# EAGLE design ningen (EAGLE 5.09)
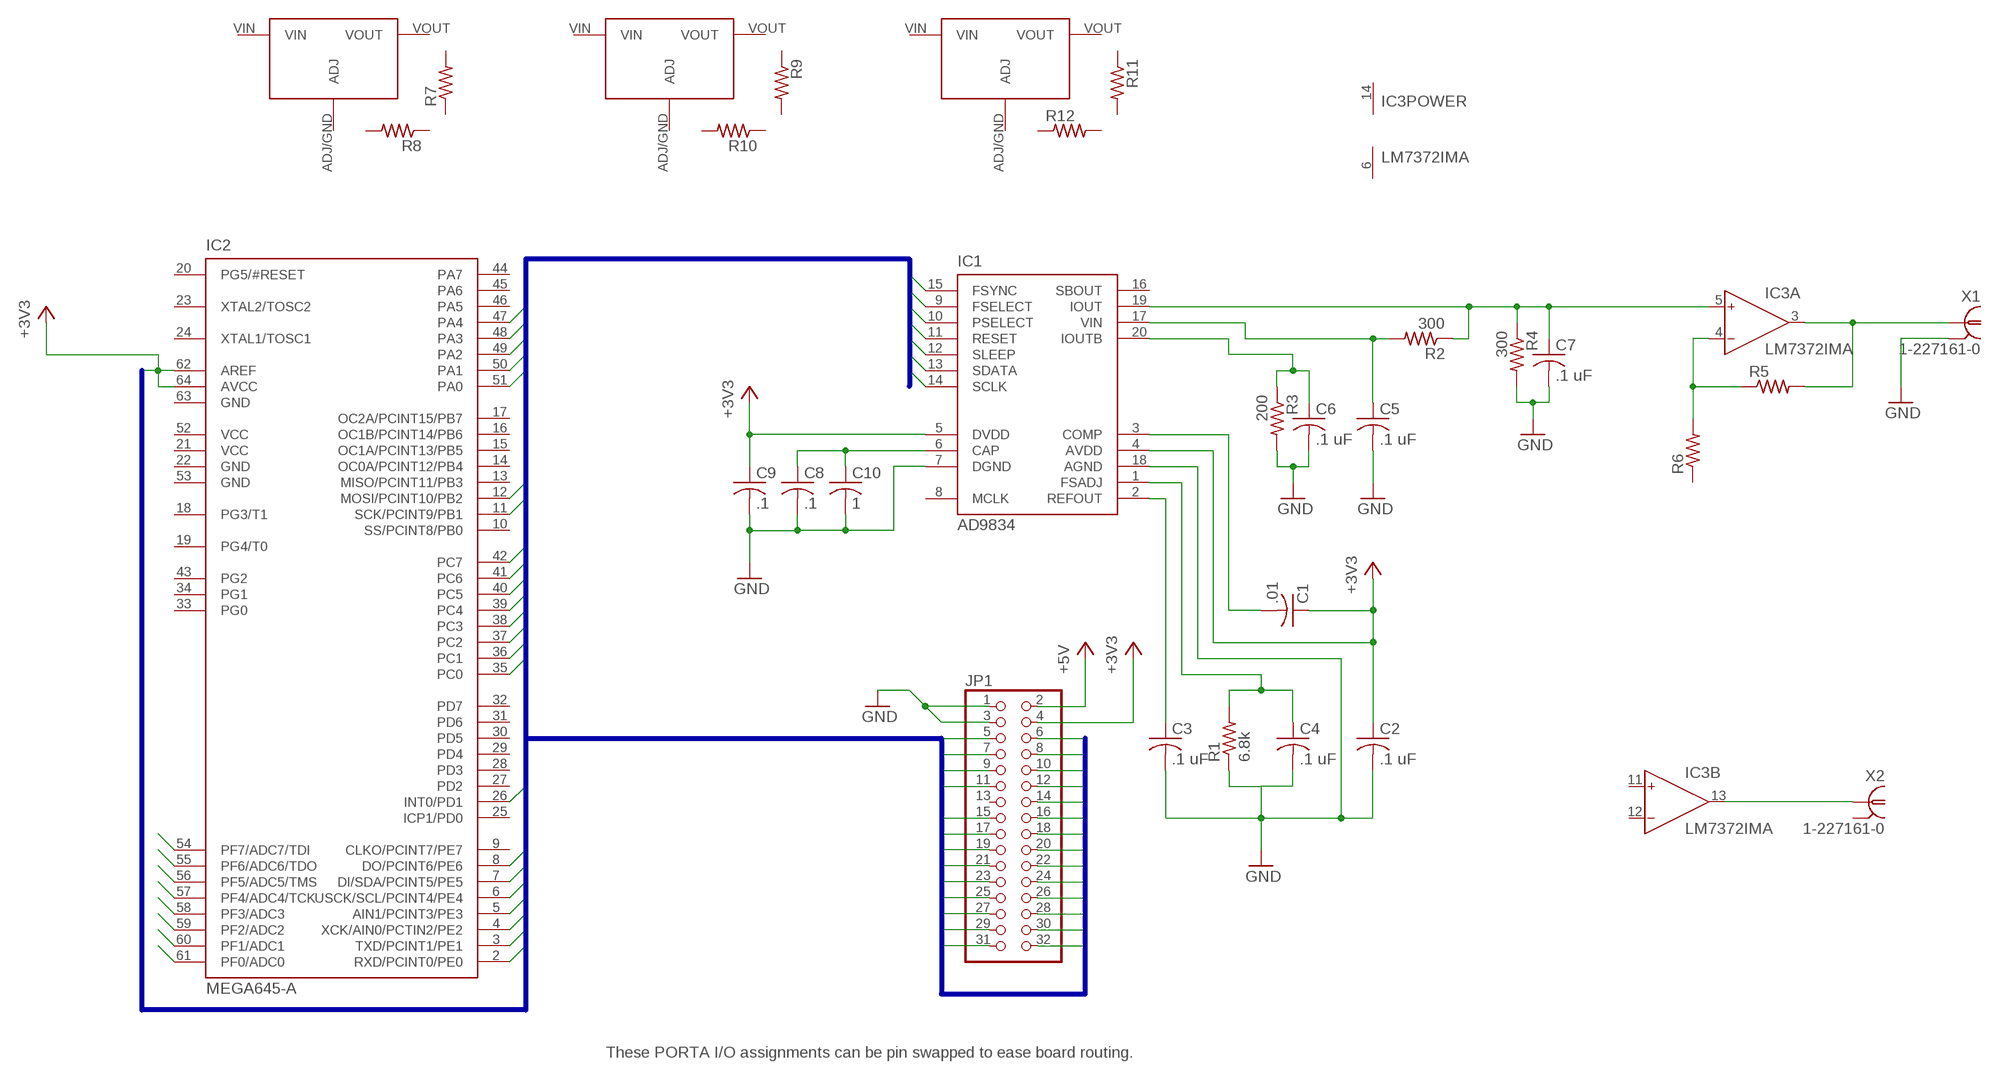
[diagram p0: schematic, sheet 1]

## Parts
C1  .01  C-USC1206  [C1206]
C2  .1 uF  C-USC1206  [C1206]
C3  .1 uF  C-USC1206  [C1206]
C4  .1 uF  C-USC1206  [C1206]
C5  .1 uF  C-USC1206  [C1206]
C6  .1 uF  C-USC1206  [C1206]
C7  .1 uF  C-USC1206  [C1206]
C8  .1  C-USC1206  [C1206]
C9  .1  C-USC1206  [C1206]
C10  1  C-USC1206  [C1206]
IC1  AD9834  [TSSOP20]
IC2  MEGA645-A  [TQFP64]
IC3  LM7372IMA  [SOIC16]
JP1  PINHD-2X16  [2X16]
R1  6.8k  R-US_R1206  [R1206]
R2  300  R-US_R1206  [R1206]
R3  200  R-US_R1206  [R1206]
R4  300  R-US_R1206  [R1206]
R5  R-US_R1206  [R1206]
R6  R-US_R1206  [R1206]
R7  R-US_M1206  [M1206]
R8  R-US_M1206  [M1206]
R9  R-US_M1206  [M1206]
R10  R-US_M1206  [M1206]
R11  R-US_M1206  [M1206]
R12  R-US_M1206  [M1206]
U$1  AP1117EG-U  [SOT-223-3L]
U$2  AP1117EG-U  [SOT-223-3L]
U$3  AP1117EG-U  [SOT-223-3L]
X1  1-227161-0  [AMP_227161]
X2  1-227161-0  [AMP_227161]

## Nets
+3V3: C1.1 C2.1 C9.1 IC1.4(AVDD) IC1.5(DVDD) JP1.2 JP1.4 ; supply symbol labelled +5V
AREF: IC2.62(AREF) IC2.64(AVCC) JP1.25 JP1.26 ; supply symbol labelled +3V3
GND: C2.2 C3.2 C4.2 C5.2 C6.2 C7.2 C8.2 C9.2 C10.2 IC1.7(DGND) IC1.18(AGND) JP1.1 JP1.3 R1.1 R3.2 R4.2 X1.2(GND)
N$1: IC3.3(A:OUT) R5.2 X1.1
N$2: IC3.13(B:OUT) X2.1
N$4: IC3.4(A:IN-) R5.1 R6.2
N$5: C8.1 C10.1 IC1.6(CAP)
N$10: C7.1 IC1.19(IOUT) IC3.5(A:IN+) R2.1 R4.1
N$11: C4.1 IC1.1(FSADJ) R1.2
N$12: C3.1 IC1.2(REFOUT)
N$13: C5.1 IC1.17(VIN) R2.2
N$15: C1.2 IC1.3(COMP)
N$17: C6.1 IC1.20(IOUTB) R3.1
PA0: IC1.12(SLEEP) IC2.51(PA0)
PA1: IC1.11(RESET) IC2.50(PA1)
PA2: IC2.49(PA2)
PA3: IC1.9(FSELECT) IC1.10(PSELECT) IC2.48(PA3)
PA4: IC1.15(FSYNC) IC2.47(PA4)
PB1: IC1.14(SCLK) IC2.11(SCK/PCINT9/PB1) IC2.12(MOSI/PCINT10/PB2)
PB2: IC1.13(SDATA)
PC0: IC2.35(PC0) JP1.5
PC1: IC2.36(PC1) JP1.6
PC2: IC2.37(PC2) JP1.7
PC3: IC2.38(PC3) JP1.8
PC4: IC2.39(PC4) JP1.9
PC5: IC2.40(PC5) JP1.10
PC6: IC2.41(PC6)
PC7: IC2.42(PC7) JP1.11 JP1.12
PD1: IC2.26(INT0/PD1) JP1.16
PE0: IC2.2(RXD/PCINT0/PE0) JP1.14
PE1: IC2.3(TXD/PCINT1/PE1) JP1.15
PE2: IC2.4(XCK/AIN0/PCTIN2/PE2) JP1.27
PE3: IC2.5(AIN1/PCINT3/PE3) JP1.28
PE4: IC2.6(USCK/SCL/PCINT4/PE4) JP1.29
PE5: IC2.7(DI/SDA/PCINT5/PE5) JP1.30
PE6: IC2.8(DO/PCINT6/PE6) JP1.31
PE7: JP1.32
PF0: IC2.61(PF0/ADC0) JP1.17
PF1: IC2.60(PF1/ADC1) JP1.18
PF2: IC2.59(PF2/ADC2) JP1.19
PF3: IC2.58(PF3/ADC3) JP1.20
PF4: IC2.57(PF4/ADC4/TCK) JP1.21
PF5: IC2.56(PF5/ADC5/TMS) JP1.22
PF6: IC2.55(PF6/ADC6/TDO) JP1.23
PF7: IC2.54(PF7/ADC7/TDI) JP1.24
Unconnected: IC1.8(MCLK) IC1.16(SBOUT) IC2.9(CLKO/PCINT7/PE7) IC2.10(SS/PCINT8/PB0) IC2.13(MISO/PCINT11/PB3) IC2.14(OC0A/PCINT12/PB4) IC2.15(OC1A/PCINT13/PB5) IC2.16(OC1B/PCINT14/PB6) IC2.17(OC2A/PCINT15/PB7) IC2.18(PG3/T1) IC2.19(PG4/T0) IC2.20(PG5/#RESET) IC2.23(XTAL2/TOSC2) IC2.24(XTAL1/TOSC1) IC2.25(ICP1/PD0) IC2.27(PD2) IC2.28(PD3) IC2.29(PD4) IC2.30(PD5) IC2.31(PD6) IC2.32(PD7) IC2.33(PG0) IC2.34(PG1) IC2.43(PG2) IC2.44(PA7) IC2.45(PA6) IC2.46(PA5) IC3.11(B:IN+) IC3.12(B:IN-) JP1.13 R6.1 R7.1 R7.2 R8.1 R8.2 R9.1 R9.2 R10.1 R10.2 R11.1 R11.2 R12.1 R12.2

## Buses
PA[0..7],PB[0..7],PC[0..7],PD[0..7],PE[0..7],PF[0..7],PG[0..4],AREF

## Notes on the sheet
- These PORTA I/O assignments can be pin swapped to ease board routing.

## Power pins joined to a net without a drawn wire
ADJ: U$1.ADJ/GND(ADJ) U$2.ADJ/GND(ADJ) U$3.ADJ/GND(ADJ)
GND: IC2.22(GND) IC2.53(GND) IC2.63(GND) X2.2(GND)
V+: IC3.14(POWER:V+)
V-: IC3.6(POWER:V-)
VCC: IC2.21(VCC) IC2.52(VCC)
VIN: U$1.VIN U$2.VIN U$3.VIN
VOUT: U$1.VOUT U$2.VOUT U$3.VOUT

## Library data of the parts
C1-C10 = rcl:C-US: CAPACITOR, American symbol
IC1 = parts:AD9834: Analog Devices AD9834
IC2 = parts:MEGA645: MICROCONTROLLER 64 Kbytes FLASH 4 Kbytes SRAM 2 Kbytes EEPROM DUAL USART 8-channel 10 bit ADC Source: avr.lbr
IC3 = parts:LM7372
JP1 = pinhead:PINHD-2X16: PIN HEADER
R1-R12 = rcl:R-US_: RESISTOR, American symbol
U$1-U$3 = parts:AP1117EG-U: DIODES, Inc. Low-Dropout 1A Adjustable Regulator
X1 X2 = con-coax:?227161*: JACK, RIGHT ANGLE, 50 OHM, PCB, BNC Source: amp_227161.pdf

## Board
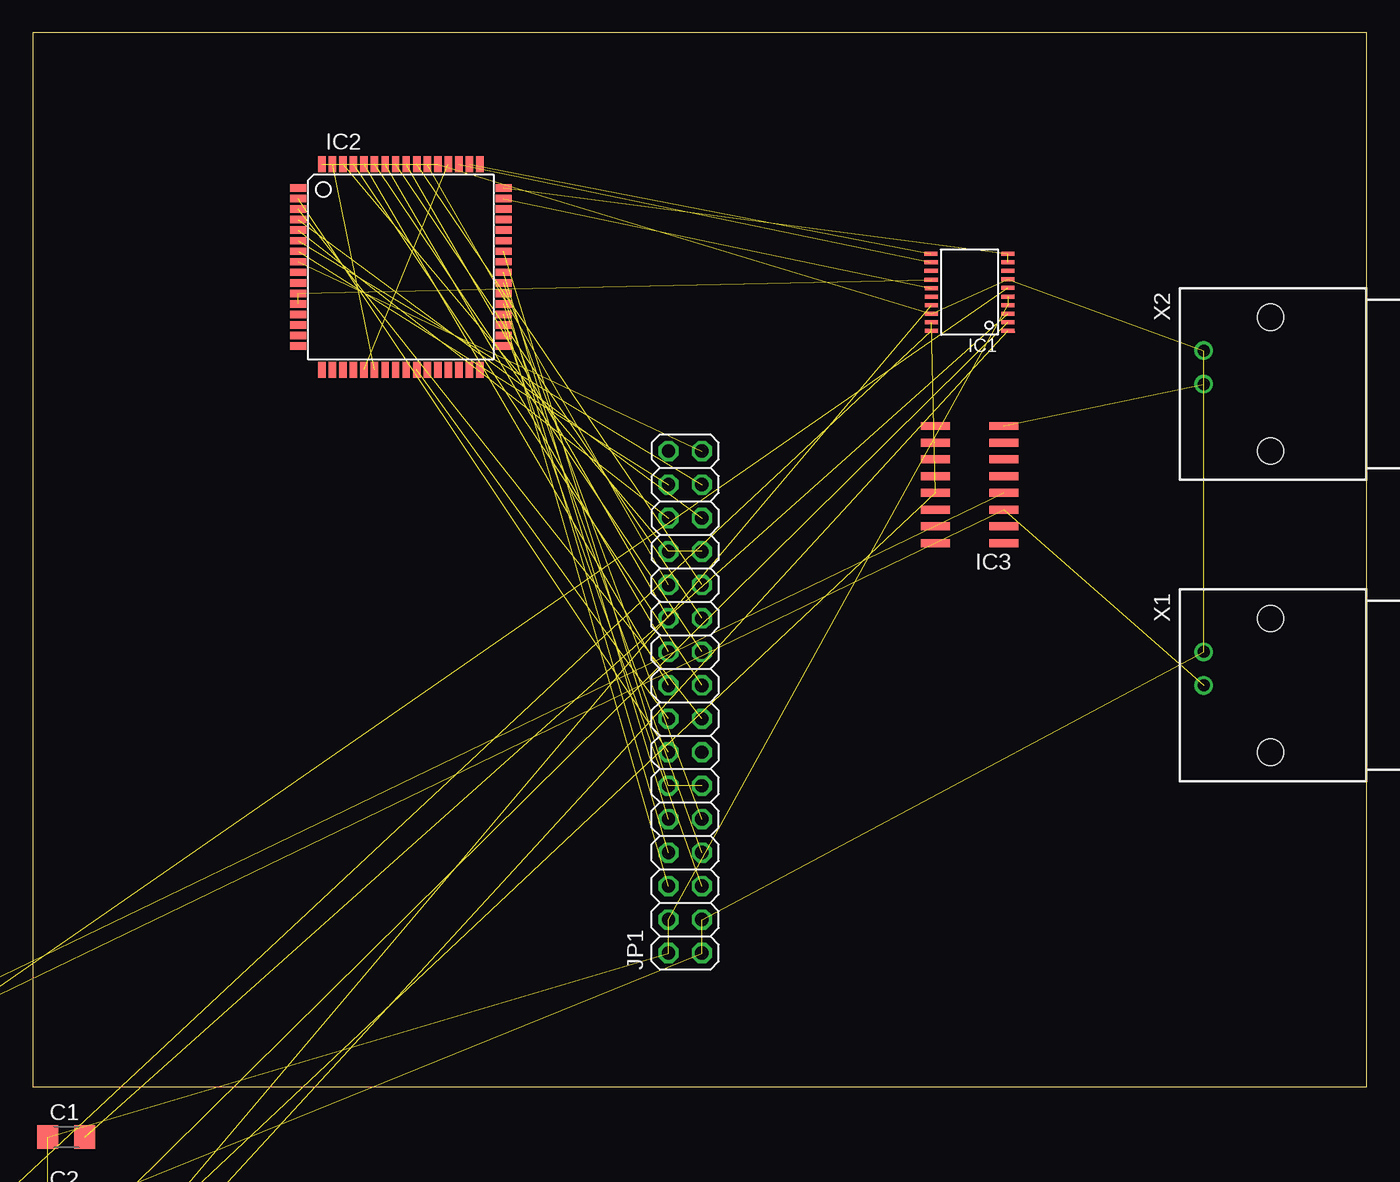
[diagram p1: board, top side]
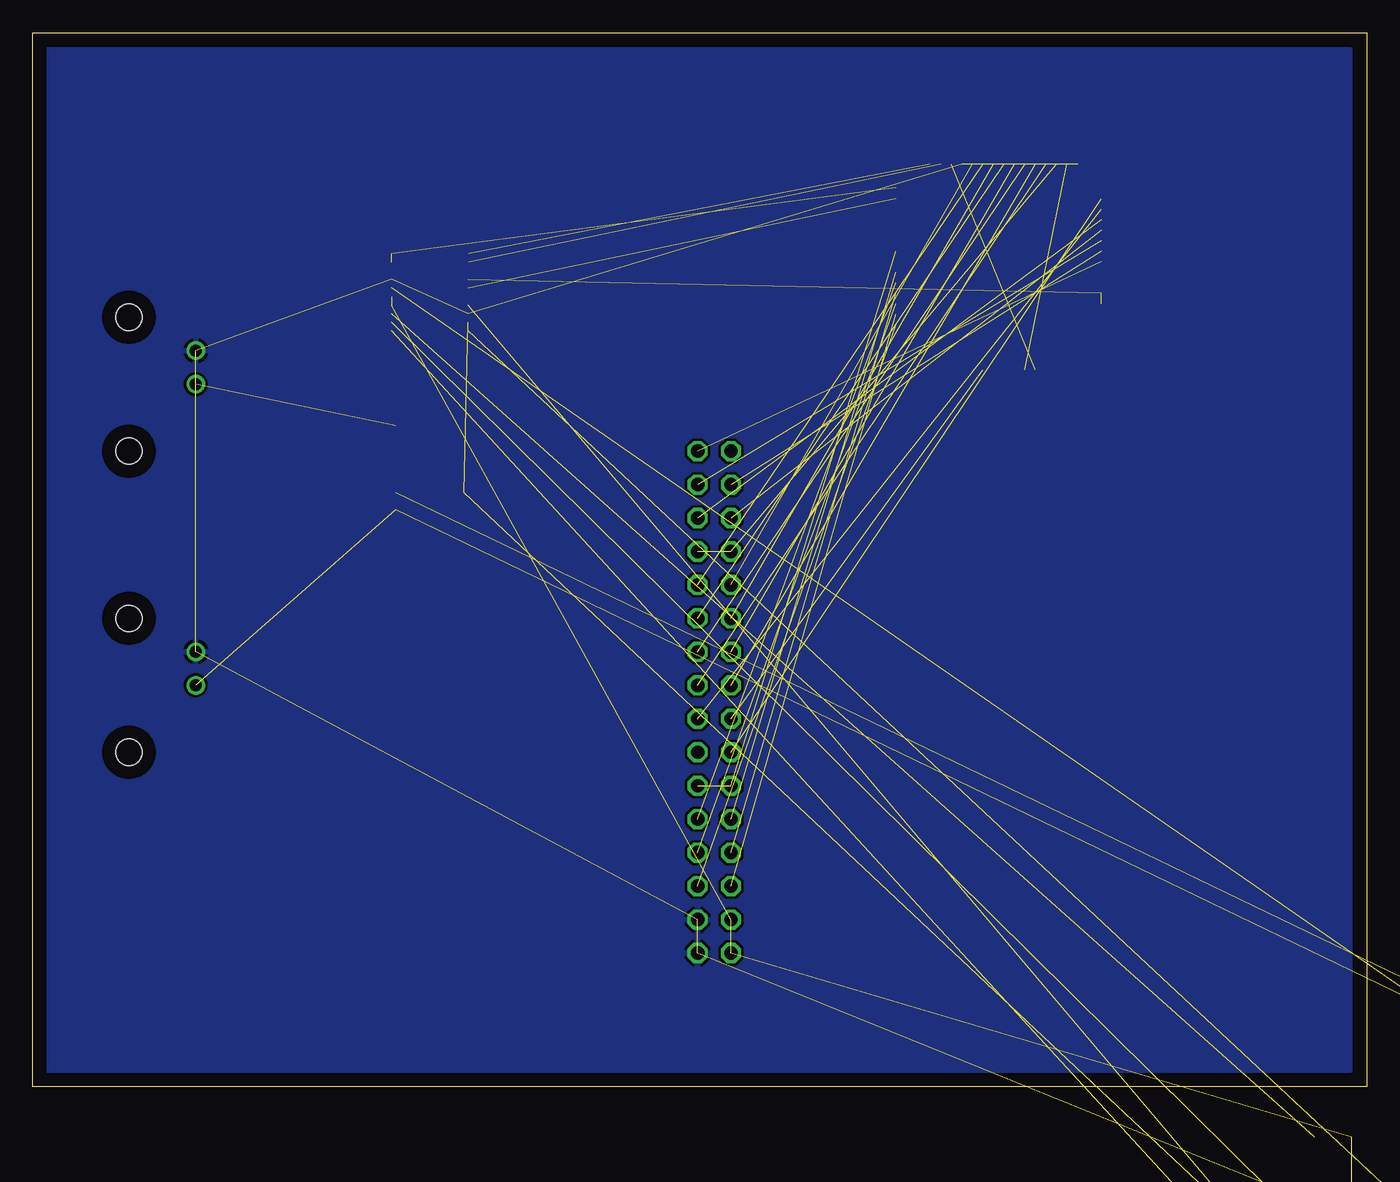
[diagram p2: board, bottom side, seen from below]

Size 101.27 x 80 mm. Coordinates in mm from the lower left corner, seen from the top.
Outline: 0,0 101.27,0 101.27,80 0,80 0,0
Copper layers (1*16): Top 0.035mm / dielectric 1.5mm / Bottom 0.035mm
Design rules "default": minimum track width 10mil, minimum drill 24mil, track to track 8mil, track to pad 8mil, pad to pad 8mil, via to via 8mil, smd to smd 8mil, copper to edge 40mil, drill to drill 8mil, minimum pad ring 10mil, minimum via ring 8mil, stop-mask expansion 4mil, vias tented up to drill 0mil, thermal gap 10mil

### Footprints (pad centres in the part's own frame; a part is rotated, then mirrored left to right if it is on the bottom)
C1206 = smd 1.6 x 1.8: 1 -1.4,0; 2 1.4,0
TSSOP20 = smd 0.305 x 0.991 rotated 270.1: 1 -2.931,3.568; 2 -2.929,2.918; 3 -2.928,2.268; 4 -2.927,1.618; 5 -2.926,0.968; 6 -2.925,0.318; 7 -2.924,-0.332; 8 -2.923,-0.982; 9 -2.922,-1.632; 10 -2.92,-2.282; 11 2.915,-2.272; 12 2.914,-1.622; 13 2.913,-0.972; 14 2.912,-0.322; 15 2.91,0.328; 16 2.909,0.978; 17 2.908,1.628; 18 2.907,2.278; 19 2.906,2.928; 20 2.905,3.578
TQFP64 = smd 1.194 x 0.559: 1 -7.8,6; 2 -7.8,5.2; 3 -7.8,4.4; 4 -7.8,3.6; 5 -7.8,2.8; 6 -7.8,2; 7 -7.8,1.2; 8 -7.8,0.4; 9 -7.8,-0.4; 10 -7.8,-1.2; 11 -7.8,-2; 12 -7.8,-2.8; 13 -7.8,-3.6; 14 -7.8,-4.4; 15 -7.8,-5.2; 16 -7.8,-6; 33 7.8,-6; 34 7.8,-5.2; 35 7.8,-4.4; 36 7.8,-3.6; 37 7.8,-2.8; 38 7.8,-2; 39 7.8,-1.2; 40 7.8,-0.4; 41 7.8,0.4; 42 7.8,1.2; 43 7.8,2; 44 7.8,2.8; 45 7.8,3.6; 46 7.8,4.4; 47 7.8,5.2; 48 7.8,6 | smd 0.559 x 1.194: 17 -6,-7.8; 18 -5.2,-7.8; 19 -4.4,-7.8; 20 -3.6,-7.8; 21 -2.8,-7.8; 22 -2,-7.8; 23 -1.2,-7.8; 24 -0.4,-7.8; 25 0.4,-7.8; 26 1.2,-7.8; 27 2,-7.8; 28 2.8,-7.8; 29 3.6,-7.8; 30 4.4,-7.8; 31 5.2,-7.8; 32 6,-7.8; 49 6,7.8; 50 5.2,7.8; 51 4.4,7.8; 52 3.6,7.8; 53 2.8,7.8; 54 2,7.8; 55 1.2,7.8; 56 0.4,7.8; 57 -0.4,7.8; 58 -1.2,7.8; 59 -2,7.8; 60 -2.8,7.8; 61 -3.6,7.8; 62 -4.4,7.8; 63 -5.2,7.8; 64 -6,7.8
SOIC16 = smd 2.2 x 0.6: 1 2.6,-4.445; 2 2.6,-3.175; 3 2.6,-1.905; 4 2.6,-0.635; 5 -2.6,-0.635; 6 -2.6,-1.905; 7 -2.6,-3.175; 8 -2.6,-4.445; 9 2.6,1.905; 10 -2.6,1.905; 11 2.6,0.635; 12 2.6,3.175; 13 2.6,4.445; 14 -2.6,0.635; 15 -2.6,3.175; 16 -2.6,4.445
2X16 = drill 1.016 octagon: 1 -19.05,-1.27; 2 -19.05,1.27; 3 -16.51,-1.27; 4 -16.51,1.27; 5 -13.97,-1.27; 6 -13.97,1.27; 7 -11.43,-1.27; 8 -11.43,1.27; 9 -8.89,-1.27; 10 -8.89,1.27; 11 -6.35,-1.27; 12 -6.35,1.27; 13 -3.81,-1.27; 14 -3.81,1.27; 15 -1.27,-1.27; 16 -1.27,1.27; 17 1.27,-1.27; 18 1.27,1.27; 19 3.81,-1.27; 20 3.81,1.27; 21 6.35,-1.27; 22 6.35,1.27; 23 8.89,-1.27; 24 8.89,1.27; 25 11.43,-1.27; 26 11.43,1.27; 27 13.97,-1.27; 28 13.97,1.27; 29 16.51,-1.27; 30 16.51,1.27; 31 19.05,-1.27; 32 19.05,1.27
R1206 = smd 1.6 x 1.803: 1 -1.422,0; 2 1.422,0
M1206 = smd 1.6 x 2: 1 -1.4,0; 2 1.4,0
SOT-223-3L = smd 1.067 x 2.184: ADJ/GND -2.3,-2.9; VIN 2.3,-2.9; VOUT 0,-2.9 | smd 3.81 x 1.93: VOUT@1 0,2.9
AMP_227161 = drill 0.9 pad 1.27 round: 1 0,-5.08; 2 -2.54,-5.08 | hole 2: -5.08,0; 5.08,0

### Placement (x,y rotation side)
C1  2.54,-3.81 0 top  (outside the outline)
C2  2.54,-8.89 0 top  (outside the outline)
C3  2.54,-13.97 0 top  (outside the outline)
C4  2.54,-24.13 0 top  (outside the outline)
C5  -11.43,-24.13 0 top  (outside the outline)
C6  -25.4,-24.13 0 top  (outside the outline)
C7  -39.37,-24.13 0 top  (outside the outline)
C8  -46.99,-24.13 0 top  (outside the outline)
C9  -54.61,-24.13 0 top  (outside the outline)
C10  -62.23,-24.13 0 top  (outside the outline)
IC1  71.12,60.96 180 top
IC2  27.94,62.23 0 top
IC3  71.12,45.72 0 top
JP1  49.53,29.21 90 top
R1  2.54,-19.05 0 top  (outside the outline)
R2  -3.81,-24.13 0 top  (outside the outline)
R3  -17.78,-24.13 0 top  (outside the outline)
R4  -31.75,-24.13 0 top  (outside the outline)
R5  -68.58,-24.13 0 top  (outside the outline)
R6  -74.93,-24.13 0 top  (outside the outline)
R7  -74.93,-60.96 0 top  (outside the outline)
R8  -74.93,-66.04 0 top  (outside the outline)
R9  -74.93,-71.12 0 top  (outside the outline)
R10  -74.93,-76.2 0 top  (outside the outline)
R11  -74.93,-81.28 0 top  (outside the outline)
R12  -74.93,-86.36 0 top  (outside the outline)
U$1  -73.66,-31.75 0 top  (outside the outline)
U$2  -73.66,-41.91 0 top  (outside the outline)
U$3  -73.66,-52.07 0 top  (outside the outline)
X1  93.98,30.48 270 top
X2  93.98,53.34 270 top

### Tracks (layer width: path | path; a pad name or v marks a point on that pad's centre or on a via)
+3V3  (6 unrouted)
ADJ  (2 unrouted)
AREF  (3 unrouted)
GND  (20 unrouted)
  pour Bottom: 1.27,78.74 1.27,1.27 100.33,1.27 100.33,78.74
N$1  (2 unrouted)
N$2  (1 unrouted)
N$4  (2 unrouted)
N$5  (2 unrouted)
N$10  (4 unrouted)
N$11  (2 unrouted)
N$12  (1 unrouted)
N$13  (2 unrouted)
N$15  (1 unrouted)
N$17  (2 unrouted)
PA0  (1 unrouted)
PA1  (1 unrouted)
PA3  (2 unrouted)
PA4  (1 unrouted)
PB1  (2 unrouted)
PC0  (1 unrouted)
PC1  (1 unrouted)
PC2  (1 unrouted)
PC3  (1 unrouted)
PC4  (1 unrouted)
PC5  (1 unrouted)
PC7  (2 unrouted)
PD1  (1 unrouted)
PE0  (1 unrouted)
PE1  (1 unrouted)
PE2  (1 unrouted)
PE3  (1 unrouted)
PE4  (1 unrouted)
PE5  (1 unrouted)
PE6  (1 unrouted)
PF0  (1 unrouted)
PF1  (1 unrouted)
PF2  (1 unrouted)
PF3  (1 unrouted)
PF4  (1 unrouted)
PF5  (1 unrouted)
PF6  (1 unrouted)
PF7  (1 unrouted)
VCC  (1 unrouted)
VIN  (2 unrouted)
VOUT  (2 unrouted)